# Altium schematic sheet 06_LCD&Camera_interface.SchDoc
size A3
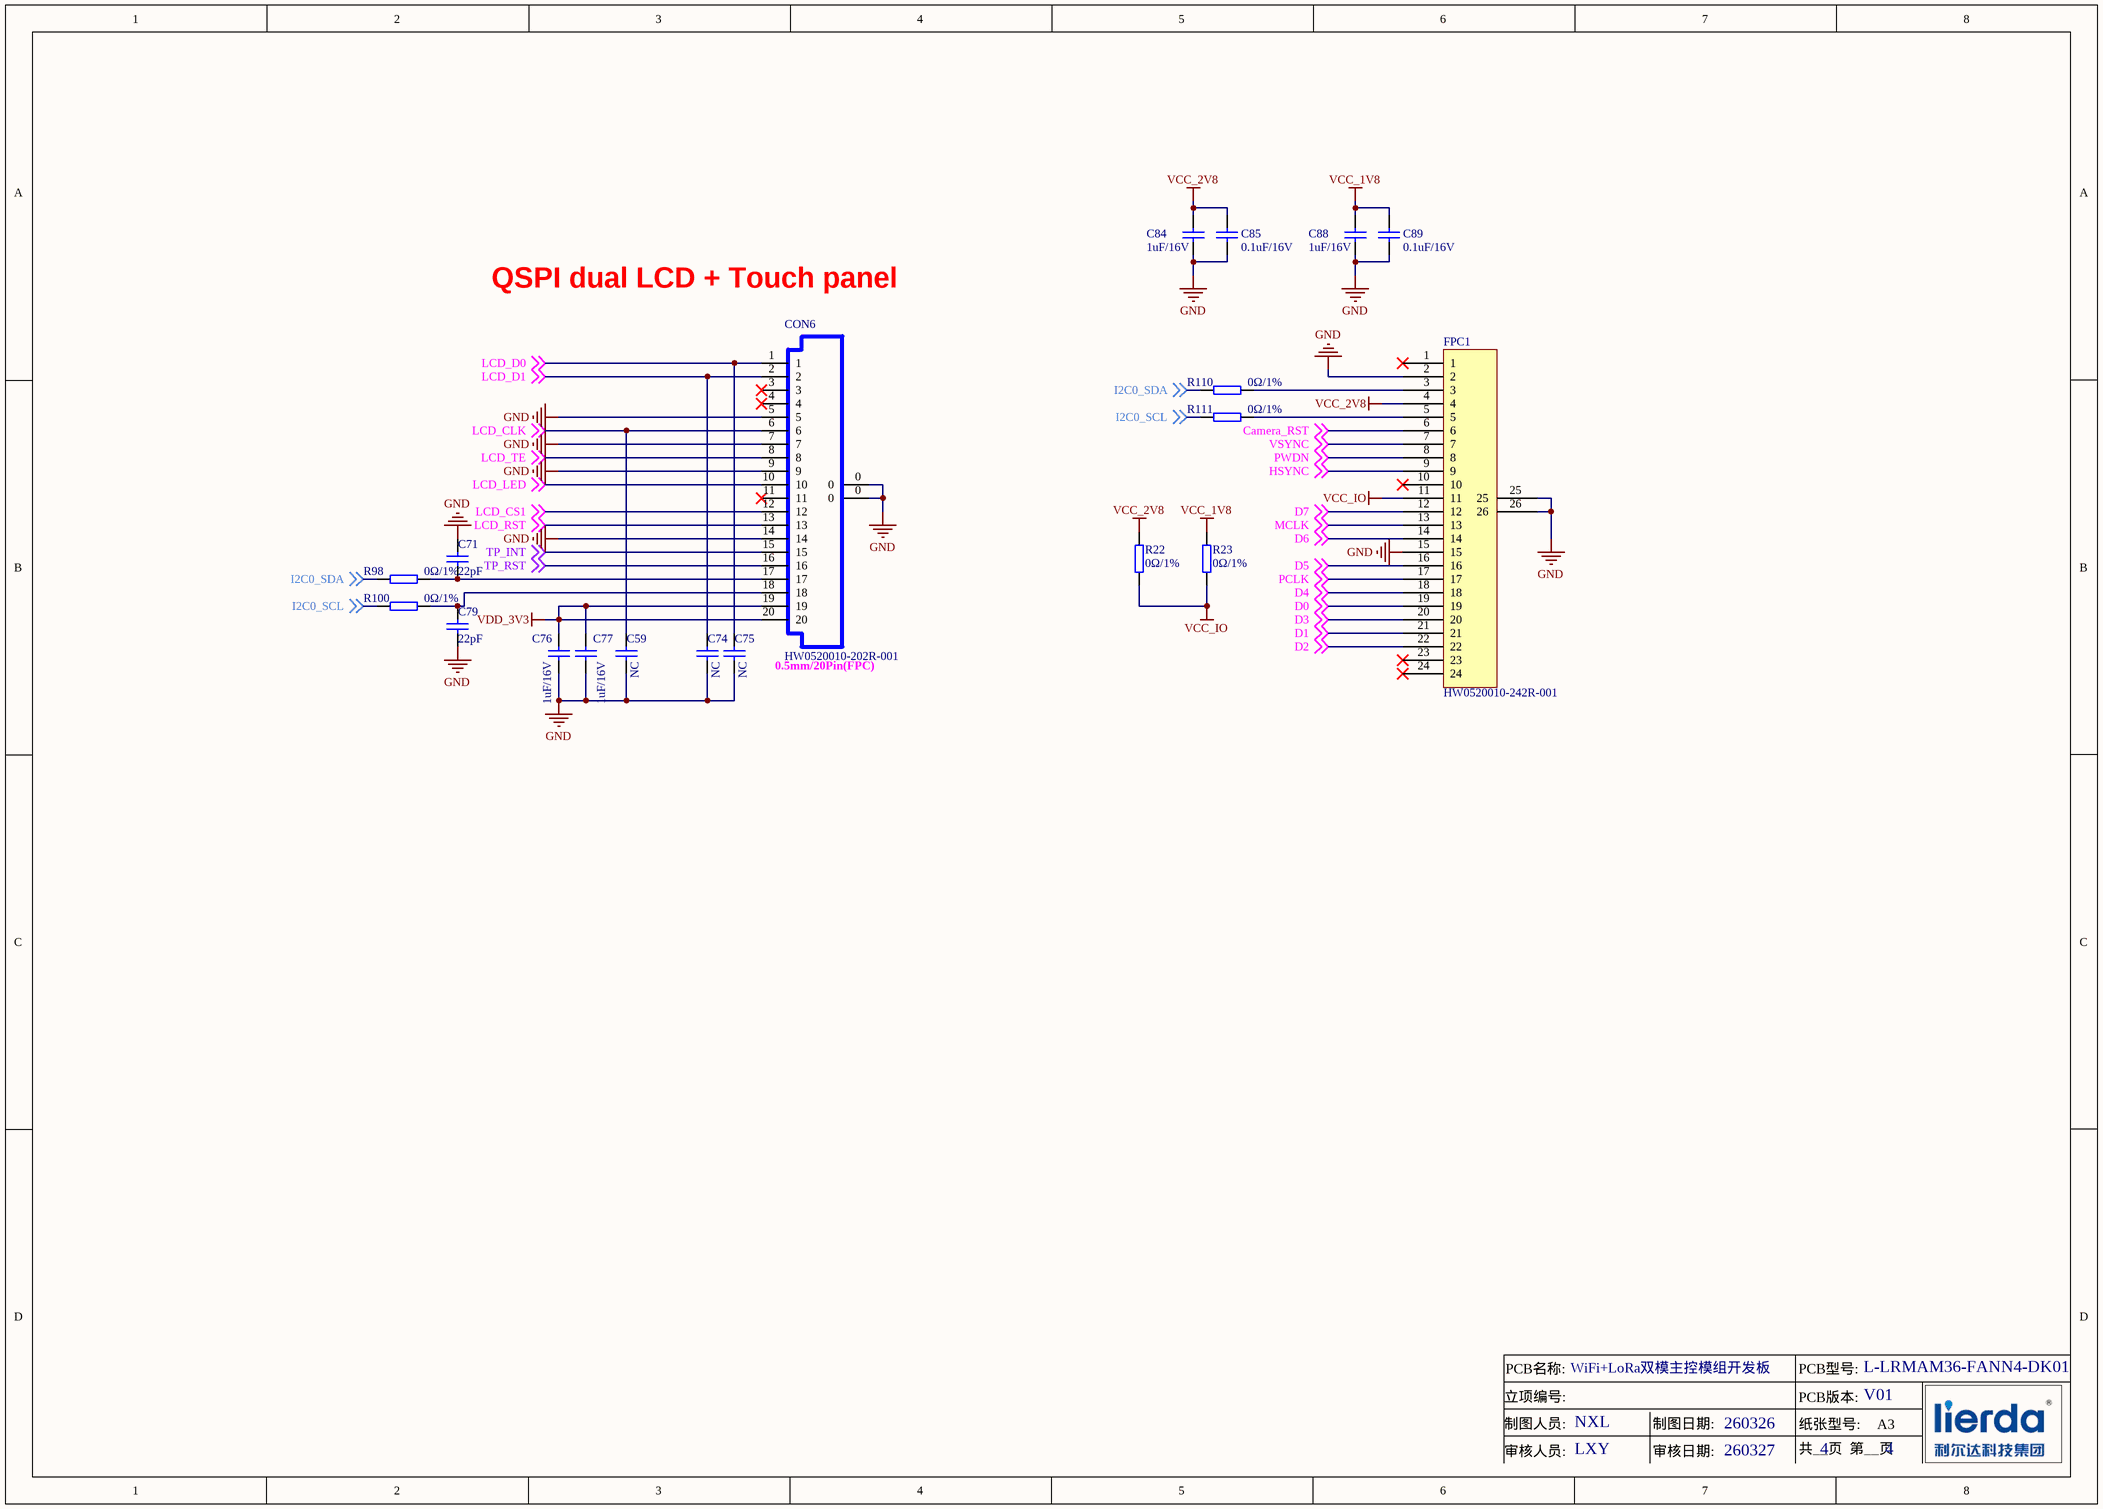
[diagram p0: 06_LCD&Camera_interface.SchDoc]

## Parts
C59  NC  [0402C_0.4D]
C71  22pF  [0402C_0.4D]
C74  NC  [0402C_0.4D]
C75  NC  [0402C_0.4D]
C76  1uF/16V  [0402C_0.4D]
C77  1uF/16V  [0402C_0.4D]
C79  22pF  [0402C_0.4D]
C84  1uF/16V  [0402C_0.4D]
C85  0.1uF/16V  [0402C_0.4D]
C88  1uF/16V  [0402C_0.4D]
C89  0.1uF/16V  [0402C_0.4D]
CON6  HW0520010-202R-001  [FPC0.5E-20P]
FPC1  HW0520010-242R-001  [FPC0.5-24P]
R22  0Ω/1%  [0402R_0.4D]
R23  0Ω/1%  [0402R_0.4D]
R98  0Ω/1%  [0402R_0.4D]
R100  0Ω/1%  [0402R_0.4D]
R110  0Ω/1%  [0402R_0.4D]
R111  0Ω/1%  [0402R_0.4D]

## Nets
GND: C59.2 C71.2 C74.2 C75.2 C76.2 C77.2 C79.1 C84.2 C85.1 C88.2 C89.1 CON6.0 CON6.5 CON6.7 CON6.9 CON6.14 FPC1.2 FPC1.15 FPC1.25 FPC1.26
VCC_1V8: C88.1 C89.2 R23.2
VCC_2V8: C84.1 C85.2 FPC1.4 R22.2
VCC_IO: FPC1.11 R22.1 R23.1
VDD_3V3: C76.1 C77.1 CON6.19 CON6.20
Camera_RST: FPC1.6 ; off-sheet Camera_RST
D0: FPC1.19 ; off-sheet D0
D1: FPC1.21 ; off-sheet D1
D2: FPC1.22 ; off-sheet D2
D3: FPC1.20 ; off-sheet D3
D4: FPC1.18 ; off-sheet D4
D5: FPC1.16 ; off-sheet D5
D6: FPC1.14 ; off-sheet D6
D7: FPC1.12 ; off-sheet D7
HSYNC: FPC1.9 ; off-sheet HSYNC
I2C0_SCL: R100.1 R111.1 ; off-sheet I2C0_SCL
I2C0_SDA: R98.1 R110.1 ; off-sheet I2C0_SDA
LCD_CLK: C59.1 CON6.6 ; off-sheet LCD_CLK
LCD_CS1: CON6.12 ; off-sheet LCD_CS1
LCD_D0: C75.1 CON6.1 ; off-sheet LCD_D0
LCD_D1: C74.1 CON6.2 ; off-sheet LCD_D1
LCD_LED: CON6.10 ; off-sheet LCD_LED
LCD_RST: CON6.13 ; off-sheet LCD_RST
LCD_TE: CON6.8 ; off-sheet LCD_TE
MCLK: FPC1.13 ; off-sheet MCLK
PCLK: FPC1.17 ; off-sheet PCLK
PWDN: FPC1.8 ; off-sheet PWDN
TP_INT: CON6.15 ; off-sheet TP_INT
TP_RST: CON6.16 ; off-sheet TP_RST
VSYNC: FPC1.7 ; off-sheet VSYNC
NetC71_1: C71.1 CON6.17 R98.2
NetC79_2: C79.2 CON6.18 R100.2
NetFPC1_3: FPC1.3 R110.2
NetFPC1_5: FPC1.5 R111.2

Not connected (* = marked no-connect by the designer): CON6 3* 4* 11*; FPC1 1* 10* 23* 24*

## Notes on the sheet
- QSPI dual LCD + Touch panel
- 0.5mm/20Pin(FPC)
- PCB名称:
- WiFi+LoRa双模主控模组开发板
- PCB型号:
- L-LRMAM36-FANN4-DK01
- 制图人员:
- 审核人员:
- 立项编号:
- NXL
- LXY
- 制图日期:
- 审核日期:
- 260326
- 260327
- 纸张型号:
- 共__页  第__页
- PCB版本:
- 4
- V01
- A3

## Library data of the parts
C59 C74-C77 C84 C88 = 1405004038: 1uF/16V/10%/X5R; 产品型号: CL05A105KO5NNNC; 品名: 陶瓷电容; 原厂品牌: SAMSUNG电容; 封装: 0402; 存货编码: 1405004038
C71 C79 = 1405001320: 22pF/50V/5%/C0G; 产品型号: V220J0402C0G500NBT; 品名: 陶瓷电容; 原厂品牌: 微容VIIYONG; 封装: 0402; 物料状态: 优选; 存货编码: 1405001320
C85 C89 = 1405000464: 0.1uF/16V/10%/X7R; 产品型号: CL05B104KO5NNNC; 品名: 陶瓷电容; 原厂品牌: SAMSUNG电容; 封装: 0402; 存货编码: 1405000464
CON6 = 1416002856: 0.50mm/20PIN; 产品型号: 60030-2001-5002; 品名: FFC，FPC连接器; 原厂品牌: 新富尔; 封装: SMD; 物料状态: 优选; 存货编码: 1416002856
R22 R23 R98 R100 R110 R111 = 1408000124: 产品型号: 0402WGF0000TCE; 品名: 厚膜贴片电阻; 原厂品牌: Uniohm; 封装: 0402; 物料状态: 优选; 存货编码: 1408000124